# Altium schematic sheet Elevator_LeTrungHieu.SchDoc
size A; SheetNumber: 1; SheetTotal: 1
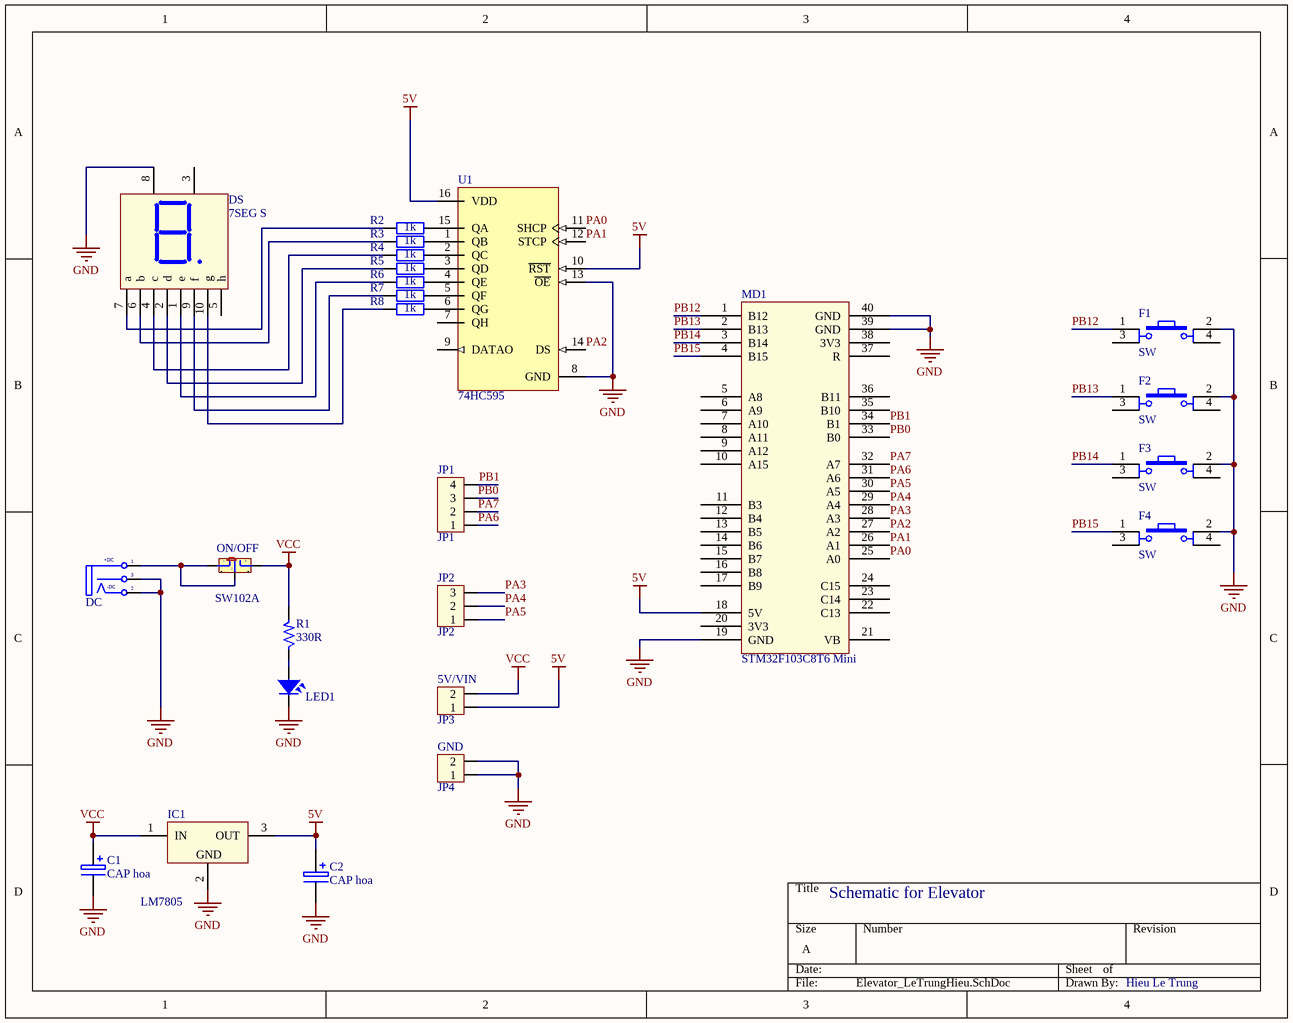
[diagram p0: Elevator_LeTrungHieu.SchDoc]

## Parts
5V/VIN  JP3  [jam2]
C1  CAP hoa  [CP2/4]
C2  CAP hoa  [CP2/4]
DC  POWER  [DC5.5*2.1]  (value not drawn)
DS  7SEG S  [7SEGS]
F1  SW  [SW4]
F2  SW  [SW4]
F3  SW  [SW4]
F4  SW  [SW4]
GND  JP4  [jam2]
IC1  LM7805  [QTO-220]
JP1  JP1  [jam4]
JP2  JP2  [jam3]
LED1  LED  [LED-5-BLUE]  (value not drawn)
MD1  STM32F103C8T6 Mini  [STM32F103C8T6 Mini]
ON/OFF  SW102A  [SW102]
R1  330R  [R1/4W]
R2  1k  [SM-RES-0805]
R3  1k  [SM-RES-0805]
R4  1k  [SM-RES-0805]
R5  1k  [SM-RES-0805]
R6  1k  [SM-RES-0805]
R7  1k  [SM-RES-0805]
R8  1k  [SM-RES-0805]
U1  74HC595  [DIP16]

## Nets
5V: 5V/VIN.1 C2.1 IC1.3(OUT) MD1.18(5V) U1.10(~{RST}) U1.16(VDD)
GND: C1.2 C2.2 DC.2(TN) DC.3(S) DS.8(Vcc) F1.2 F2.2 F3.2 F4.2 GND.1 GND.2 IC1.2(GND) LED1.2 MD1.19(GND) MD1.39(GND) MD1.40(GND) U1.8(GND) U1.13(~{OE})
VCC: 5V/VIN.2 C1.1 IC1.1(IN) ON/OFF.3 R1.2
PA0: MD1.25(A0) U1.11(SHCP)
PA1: MD1.26(A1) U1.12(STCP)
PA2: MD1.27(A2) U1.14(DS)
PA3: JP2.3 MD1.28(A3)
PA4: JP2.2 MD1.29(A4)
PA5: JP2.1 MD1.30(A5)
PA6: JP1.1 MD1.31(A6)
PA7: JP1.2 MD1.32(A7)
PB0: JP1.3 MD1.33(B0)
PB1: JP1.4 MD1.34(B1)
PB12: F1.1 MD1.1(B12)
PB13: F2.1 MD1.2(B13)
PB14: F3.1 MD1.3(B14)
PB15: F4.1 MD1.4(B15)
NetDC_1: DC.1(T) ON/OFF.1 ON/OFF.2
NetDS_1: DS.1(e) R6.1
NetDS_2: DS.2(d) R5.1
NetDS_4: DS.4(c) R4.1
NetDS_6: DS.6(b) R3.1
NetDS_7: DS.7(a) R2.1
NetDS_9: DS.9(f) R7.1
NetDS_10: DS.10(g) R8.1
NetLED1_1: LED1.1 R1.1
NetR2_2: R2.2 U1.15(QA)
NetR3_2: R3.2 U1.1(QB)
NetR4_2: R4.2 U1.2(QC)
NetR5_2: R5.2 U1.3(QD)
NetR6_2: R6.2 U1.4(QE)
NetR7_2: R7.2 U1.5(QF)
NetR8_2: R8.2 U1.6(QG)

Not connected (* = marked no-connect by the designer): DS 3(Vcc) 5(h); F1 3 4; F2 3 4; F3 3 4; F4 3 4; MD1 5(A8) 6(A9) 7(A10) 8(A11) 9(A12) 10(A15) 11(B3) 12(B4) 13(B5) 14(B6) 15(B7) 16(B8) 17(B9) 20(3V3) 21(VB) 22(C13) 23(C14) 24(C15) 35(B10) 36(B11) 37(R) 38(3V3); ON/OFF 4 5; U1 7(QH) 9(DATAO)

## Notes on the sheet
- Schematic for Elevator
- Hieu Le Trung
- (in symbol DCIN) +DC; -DC

## Library data of the parts
5V/VIN GND = Jam 2
C1 C2 = CAP hoa: Cap
DC = DCIN
DS = LED7S: Single 7 Seg Dipslay; Value: LED 7S SEG
F1-F4 = SW4: Switch button 4 pin; Value: Button chip 4 pin
IC1 = LM78xx: On ap +, from + 5 to + 24VDC; Value: LM7805
JP1 = jam 4: Value: Connector 4
JP2 = jam 3: Value: Connector 3
LED1 = LED_1: LED Single colour Green and Red; Value: LED 3 ly Single Colour
ON/OFF = SW102A: Switch 102 on Broad; Value: Switch 102 On Board
R1 = Res
R2-R8 = R1/4W: Resistor 1/4W; Value: R1/4W - 1K
U1 = 74HC595: 8-Bit Serial-Input/Serial or Prallel-Output Shift Register with Latched 3-State Outputs; Published: 15-Apr-2002; DatasheetVersion: Mar-2000; PackageVersion: Apr-2000; PackageReference: 648-08; Publisher: Altium Limited; PackageDescription: DIP; 16 Leads; Row Spacing 7.62 mm; Pitch 2.54 mm; Code_JEDEC: MS-001-BB; ComponentLink1Description: Manufacturer Link; ComponentLink1URL: http://www.onsemi.com/; ComponentLink2Description: Datasheet; ComponentLink2URL: http://www.onsemi.com/pub/Collateral/MC74HC595A-D.PDF